# Altium schematic sheet SYSTEM.SchDoc: DARKYDEN_SYSTEM
size Letter; ApprovedBy: APPROUVÉ PAR; Author: Harold Malbrouck; Organization: Cegep Limoilou; Address1: 1300, 8e Avenue; Address2: Québec, QC; Address3: Canada; Address4: G1J 5L5; Revision: Rev.A; SheetNumber: 12; SheetTotal: 12
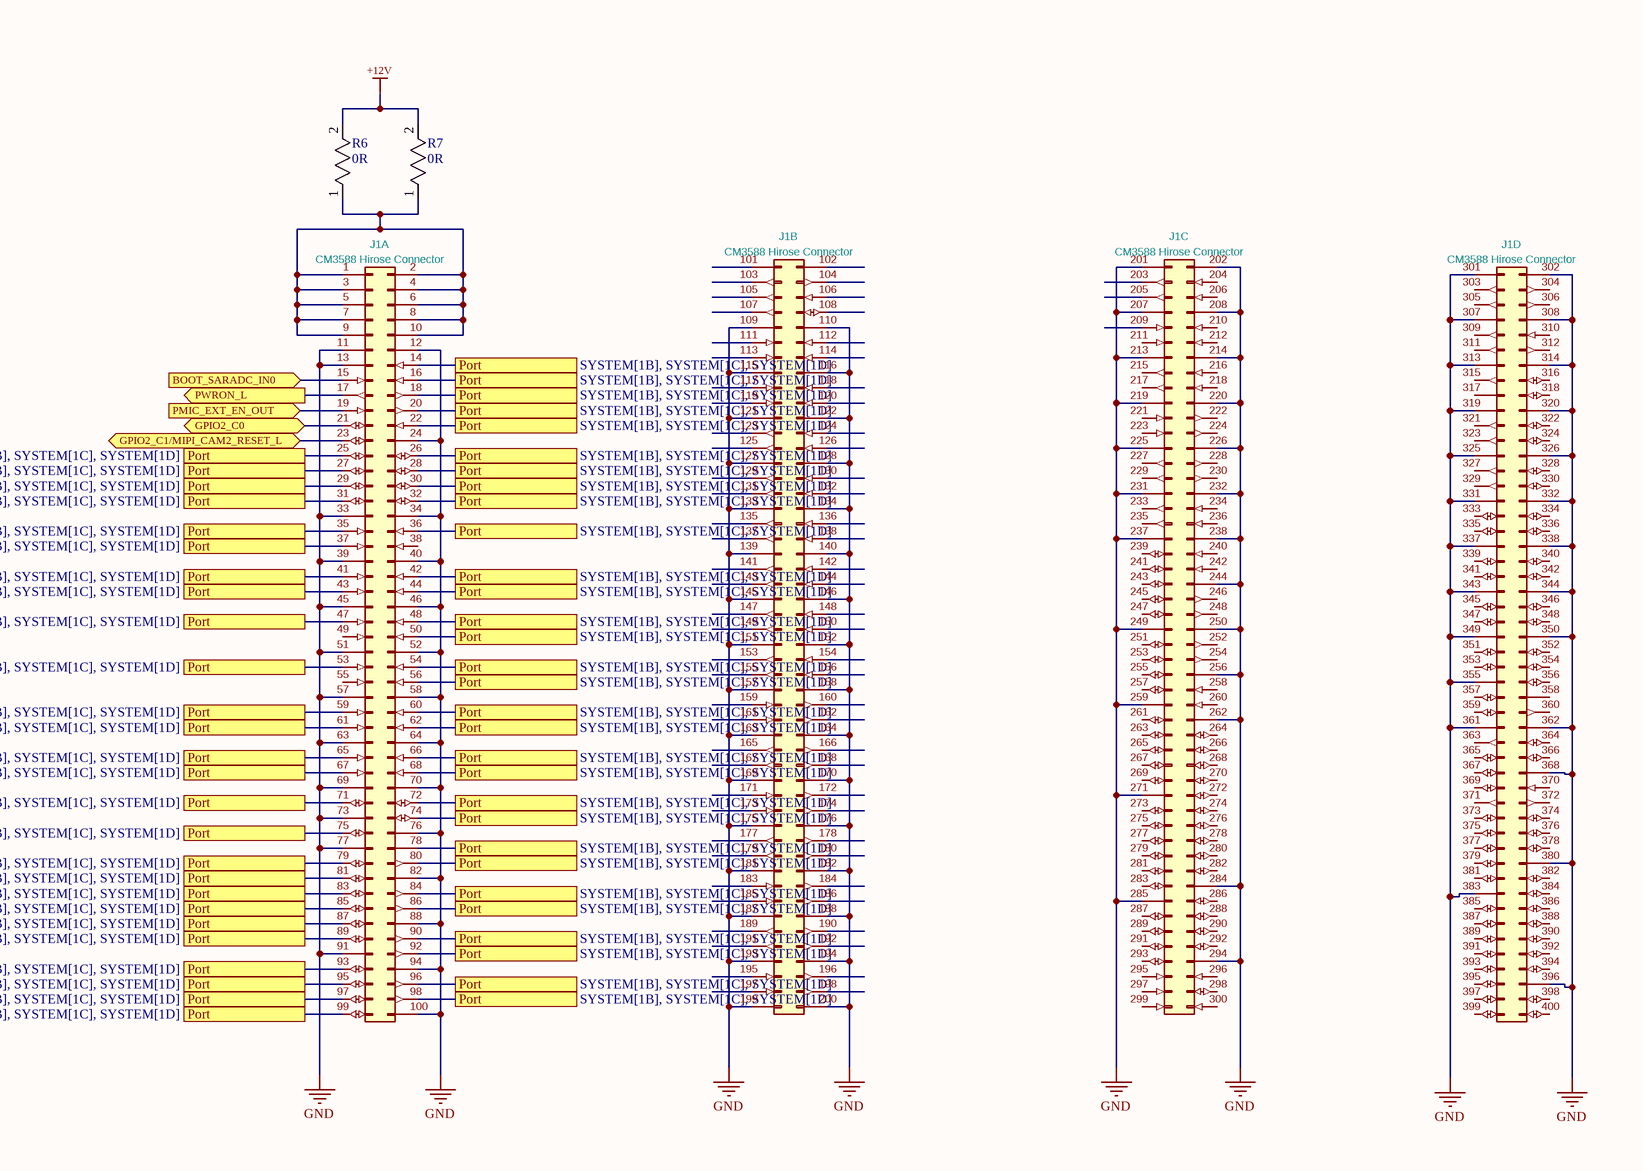
[diagram p0: SYSTEM.SchDoc, right]

## Parts
J1  CM3588 Hirose Connector  [CM3588]  (parts A,B,C,D of 4)
R6  0R  [RES_0816_SUS]
R7  0R  [RES_0816_SUS]

## Ports
BOOT_SARADC_IN0 (in), GPIO2_C0 (bidir), GPIO2_C1/MIPI_CAM2_RESET_L (bidir), PMIC_EXT_EN_OUT (in), Port (see SYSTEM[1B], SYSTEM[1C], SYSTEM[1D]), PWRON_L (out)

## Nets
+12V: R6.2 R7.2
GND: J1.11(GND) J1.12(GND) J1.13(GND) J1.24(GND) J1.33(GND) J1.34(GND) J1.39(GND) J1.40(GND) J1.45(GND) J1.46(GND) J1.51(GND) J1.52(GND) J1.57(GND) J1.58(GND) J1.63(GND) J1.64(GND) J1.69(GND) J1.70(GND) J1.73(GND) J1.76(GND) J1.77(GND) J1.82(GND) J1.88(GND) J1.91(GND) J1.94(GND) J1.100(GND) J1.109(GND) J1.110(GND) J1.115(GND) J1.116(GND) J1.121(GND) J1.122(GND) J1.127(GND) J1.128(GND) J1.133(GND) J1.134(GND) J1.139(GND) J1.140(GND) J1.145(GND) J1.146(GND) J1.151(GND) J1.152(GND) J1.157(GND) J1.158(GND) J1.163(GND) J1.164(GND) J1.169(GND) J1.170(GND) J1.175(GND) J1.176(GND) J1.181(GND) J1.182(GND) J1.187(GND) J1.188(GND) J1.193(GND) J1.194(GND) J1.199(GND) J1.200(GND) J1.201(GND) J1.202(GND) J1.207(GND) J1.208(GND) J1.213(GND) J1.214(GND) J1.219(GND) J1.220(GND) J1.225(GND) J1.226(GND) J1.231(GND) J1.232(GND) J1.237(GND) J1.238(GND) J1.244(GND) J1.249(GND) J1.250(GND) J1.256(GND) J1.259(GND) J1.262(GND) J1.271(GND) J1.284(GND) J1.285(GND) J1.294(GND) J1.301(GND) J1.302(GND) J1.307(GND) J1.308(GND) J1.313(GND) J1.314(GND) J1.319(GND) J1.320(GND) J1.325(GND) J1.326(GND) J1.331(GND) J1.332(GND) J1.337(GND) J1.338(GND) J1.343(GND) J1.344(GND) J1.349(GND) J1.350(GND) J1.355(GND) J1.361(GND) J1.362(GND) J1.368(GND) J1.380(GND) J1.383(GND) J1.396(GND)
BOOT_SARADC_IN0: J1.15(BOOT_SARADC_IN0) ; port BOOT_SARADC_IN0
GPIO2_C0: J1.21(GPIO2_C0) ; port GPIO2_C0
GPIO2_C1/MIPI_CAM2_RESET_L: J1.23(GPIO2_C1/MIPI_CAM2_RESET_L) ; port GPIO2_C1/MIPI_CAM2_RESET_L
PMIC_EXT_EN_OUT: J1.19(PMIC_EXT_EN_OUT) ; port PMIC_EXT_EN_OUT
Port: J1.14(SARADC_VIN6_HW_ID2) J1.16(RESET_L) J1.18(VDC_MODE) J1.20(UART2_TX_M0_DEBUG) J1.22(UART2_RX_M0_DEBUG) J1.25(GPIO2_C2/MIPI_CAM2_PDN_L) J1.26(GPIO4_C2) J1.27(GPIO2_C3) J1.28(GPIO4_C3) J1.29(GPIO2_C4) J1.30(GPIO4_C4) J1.31(GPIO4_C6) J1.32(GPIO4_C5) J1.35(MIPI_CSI1_RX_CLK1P) J1.36(MIPI_CSI0_RX_CLK1P) J1.37(MIPI_CSI1_RX_CLK1N) J1.41(MIPI_CSI1_RX_D3P) J1.42(MIPI_CSI0_RX_D3P) J1.43(MIPI_CSI1_RX_D3N) J1.44(MIPI_CSI0_RX_D3N) J1.47(MIPI_CSI1_RX_D2P) J1.48(MIPI_CSI0_RX_D2P) J1.50(MIPI_CSI0_RX_D2N) J1.53(MIPI_CSI1_RX_CLK0P) J1.54(MIPI_CSI0_RX_CLK0P) J1.56(MIPI_CSI0_RX_CLK0N) J1.59(MIPI_CSI1_RX_D1P) J1.60(MIPI_CSI0_RX_D1P) J1.61(MIPI_CSI1_RX_D1N) J1.62(MIPI_CSI0_RX_D1N) J1.65(MIPI_CSI1_RX_D0P) J1.66(MIPI_CSI0_RX_D0P) J1.67(MIPI_CSI1_RX_D0N) J1.68(MIPI_CSI0_RX_D0N) J1.71(GPIO1_B6) J1.72(LED3_25GLAN_25GLED) J1.74(LED2_25GLAN_1GLED) J1.75(GPIO1_B7) J1.78(P25G_MDIP0) J1.79(GPIO2_A6) J1.80(P25G_MDIN0) J1.81(GPIO2_A7) J1.83(GPIO2_B0) J1.84(P25G_MDIP1) J1.85(GPIO2_B1_GPIO,) J1.86(P25G_MDIN1) J1.87(GPIO2_B2) J1.89(GPIO2_B3) J1.90(P25G_MDIP2) J1.92(P25G_MDIN2) J1.93(GPIO2_B4) J1.95(GPIO2_B5) J1.96(P25G_MDIP3) J1.97(GPIO2_B6) J1.98(P25G_MDIN3) J1.99(GPIO2_B7) ; port Port
PWRON_L: J1.17(PWRON_L) ; port PWRON_L
NetJ1_1: J1.1(VDD_DCIN) J1.2(VDD_DCIN) J1.3(VDD_DCIN) J1.4(VDD_DCIN) J1.5(VDD_DCIN) J1.6(VDD_DCIN) J1.7(VDD_DCIN) J1.8(VDD_DCIN) J1.9(VDD_DCIN) J1.10(VDD_DCIN) R6.1 R7.1

Not connected (* = marked no-connect by the designer): J1 38(MIPI_CSI0_RX_CLK1N) 49(MIPI_CSI1_RX_D2N) 55(MIPI_CSI1_RX_CLK0N) 101(RECOVERY) 102(GND_AUDUO) 103(HPR) 104(HPL) 105(I2C7_SDA_M0) 106(MIC_IN) 107(I2C7_SCL_M0) 108(GPIO1_C4/HP_DET_L) 111(MIPI_DPHY0_RX_D2P) 112(MIPI_DPHY0_RX_D3P) 113(MIPI_DPHY0_RX_D2N) 114(MIPI_DPHY0_RX_D3N) 117(MIPI_DPHY0_RX_D1P) 118(MIPI_DPHY0_RX_CLKP) 119(MIPI_DPHY0_RX_D1N) 120(MIPI_DPHY0_RX_CLKN) 123(MIPI_DPHY0_TX_D3P) 124(MIPI_DPHY0_RX_D0P) 125(MIPI_DPHY0_TX_D3N) 126(MIPI_DPHY0_RX_D0N) 129(MIPI_DPHY0_TX_D2P) 130(MIPI_DPHY1_RX_D3P) 131(MIPI_DPHY0_TX_D2N) 132(MIPI_DPHY1_RX_D3N) 135(MIPI_DPHY0_TX_CLKP) 136(MIPI_DPHY1_RX_D2P) 137(MIPI_DPHY0_TX_CLKN) 138(MIPI_DPHY1_RX_D2N) 141(MIPI_DPHY0_TX_D1P) 142(MIPI_DPHY1_RX_CLKP) 143(MIPI_DPHY0_TX_D1N) 144(MIPI_DPHY1_RX_CLKN) 147(MIPI_DPHY0_TX_D0P) 148(MIPI_DPHY1_RX_D1P) 149(MIPI_DPHY0_TX_D0N) 150(MIPI_DPHY1_RX_D1N) 153(TYPEC0_SSTX2P) 154(MIPI_DPHY1_RX_D0P) 155(TYPEC0_SSTX2N) 156(MIPI_DPHY1_RX_D0N) 159(TYPEC0_SSRX2P) 160(MIPI_DPHY1_TX_D3P) 161(TYPEC0_SSRX2N) 162(MIPI_DPHY1_TX_D3N) 165(TYPEC0_SSTX1P) 166(MIPI_DPHY1_TX_D2P) 167(TYPEC0_SSTX1N) 168(MIPI_DPHY1_TX_D2N) 171(TYPEC0_SSRX1P) 172(MIPI_DPHY1_TX_CLKP) 173(TYPEC0_SSRX1N) 174(MIPI_DPHY1_TX_CLKN) 177(TYPEC1_SSTX2P) 178(MIPI_DPHY1_TX_D1P) 179(TYPEC1_SSTX2N) 180(MIPI_DPHY1_TX_D1N) 183(TYPEC1_SSRX2P) 184(MIPI_DPHY1_TX_D0P) 185(TYPEC1_SSRX2N) 186(MIPI_DPHY1_TX_D0N) 189(TYPEC1_SSTX1P) 190(TYPEC0_OTG_DP) 191(TYPEC1_SSTX1N) 192(TYPEC0_OTG_DM) 195(TYPEC1_SSRX1P) 196(TYPEC1_OTG_DP) 197(TYPEC1_SSRX1N) 198(TYPEC1_OTG_DM) 203(PCIE20_1_TXP/SATA30_1_TXP) 204(PCIE30_PORT0_RX0P) 205(PCIE20_1_TXN/SATA30_1_TXN) 206(PCIE30_PORT0_RX0N) 209(PCIE20_1_RXP/SATA30_1_RXP) 210(PCIE30_PORT0_RX1P) 211(PCPIE20_1_RXN/SATA30_1_RXN) 212(PCIE30_PORT0_RX1N) 215(PCIE20_1_REFCLKP) 216(PCIE30_PORT0_REFCLKP_IN) 217(PCIE20_1_REFCLKN) 218(PCIE30_PORT0_REFCLKN_IN) 221(PCIE20_2_RXP/SATA30_2_RXP/USB30_2_SSRXP) 222(PCIE30_PORT0_TX0P) 223(PCIE20_2_RXN/SATA30_2_RXN/USB30_2_SSRXN) 224(PCIE30_PORT0_TX0N) 227(PCIE20_2_REFCLKP) 228(PCIE30_PORT0_TX1P) 229(PCIE20_2_REFCLKN) 230(PCIE30_PORT0_TX1N) 233(PCIE20_2_TXP/SATA30_2_TXP/USB30_2_SSTXP) 234(PCIE30_PORT1_RX2P) 235(PCIE20_2_TXN/SATA30_2_TXN/USB30_2_SSTXN) 236(PCIE30_PORT1_RX2N) 239(GPIO1_D2) 240(PCIE30_PORT1_RX3P) 241(GPIO1_D3) 242(PCIE30_PORT1_RX3N) 243(GPIO1_C1) 245(GPIO1_C0) 246(PCIE30_PORT1_TX2P) 247(GPIO0_B2) 248(PCIE30_PORT1_TX2N) 251(GPIO4_A0) 252(PCIE30_PORT1_TX3P) 253(GPIO4_A1) 254(PCIE30_PORT1_TX3N) 255(GPIO4_A2) 257(GPIO4_A3) 258(PCIE30_PORT1_REFCLKP_IN) 260(PCIE30_PORT1_REFCLKN_IN) 261(GPIO4_B0) 263(GPIO4_B3) 264(GPIO0_D3) 265(GPIO4_B4) 266(GPIO0_D4) 267(GPIO4_B5) 268(GPIO0_D5) 269(GPIO4_B6) 270(GPIO0_C4) 272(GPIO0_C5) 273(GPIO1_A0) 274(GPIO0_C6) 275(GPIO1_A1) 276(GPIO1_B0) 277(GPIO1_A2) 278(GPIO1_B1) 279(GPIO1_A3) 280(GPIO1_B2) 281(GPIO1_A4) 282(GPIO1_B3) 283(GPIO1_A7) 286(GPIO1_D6) 287(GPIO3_C0) 288(GPIO1_D7) 289(GPIO3_C1) 290(GPIO1_B4) 291(GPIO3_C2) 292(GPIO1_B5) 293(GPIO3_C3) 295(HDMITX0_HPDIN_M0) 296(I2C6_SCL_M0) 297(HDMITX1_HPDIN_M0) 298(I2C6_SDA_M0) 299(GPIO1_D5/HDMIIRX_DET_L) 300(VBAT_RTC) 303(HDMI1_TX2P_PORT) 304(TYPEC0_SBU1_OUT) 305(HDMI1_TX2N_PORT) 306(TYPEC0_SBU2_OUT) 309(HDMI1_TX1P_PORT) 310(TYPEC1_SBU1) 311(HDMI1_TX1N_PORT) 312(TYPEC1_SBU2) 315(HDMI1_TX0P_PORT) 316(USB20_HOST1_DP) 317(HDMI1_TX0N_PORT) 318(USB20_HOST1_DM) 321(HDMI1_TX3P_PORT) 322(USB20_HOST0_DP) 323(HDMI1_TX3N_PORT) 324(USB20_HOST0_DM) 327(HDMI1_TX_SBDP) 328(HDMI_RX_D2P_PORT) 329(HDMI1_TX_SBDN) 330(HDMI_RX_D2N_PORT) 333(HDMI0_TX2P_PORT) 334(HDMI_RX_D1P_PORT) 335(HDMI0_TX2N_PORT) 336(HDMI_RX_D1N_PORT) 339(HDMI0_TX1P_PORT) 340(HDMI_RX_D0P_PORT) 341(HDMI0_TX1N_PORT) 342(HDMI_RX_D0N_PORT) 345(HDMI0_TX0P_PORT) 346(HDMI_RX_CLKP_PORT) 347(HDMI0_TX0N_PORT) 348(HDMI_RX_CLKN_PORT) 351(HDMI0_TX3P_PORT) 352(SDMMC0_D2) 353(HDMI0_TX3N_PORT) 354(SDMMC0_D3) 356(SDMMC0_CMD) 357(HDMI0_TX_SBDP) 358(VCC3V3_SD_S0) 359(HDMI0_TX_SBDN) 360(SD_CLK) 363(HDMITX0_SCL_M0) 364(SDMMC0_D0) 365(HDMITX0_SDA_M0) 366(SDMMC0_D1) 367(HDMITX0_CEC_M0) 369(HDMI0_TX_ON_H) 370(GPIO0_A4/SDMMC_DET_L) 371(HDMITX1_SCL_M1) 372(HDMI_RX_SCL_M1) 373(HDMITX1_SDA_M1) 374(HDMI_RX_SDA_M1) 375(HDMITX1_CEC_M2) 376(HDMI_RX_CEC) 377(HDMI1_TX_ON_H) 378(HDMIIRX_HPDOUT_H) 379(GPIO3_D0) 381(GPIO3_C7) 382(GPIO3_B0) 384(GPIO3_B1) 385(GPIO3_D5) 386(GPIO3_B2) 387(GPIO3_A0) 388(GPIO3_B3) 389(GPIO3_A1) 390(GPIO3_B4) 391(GPIO3_A2) 392(GPIO3_B5) 393(GPIO3_A3) 394(GPIO3_B6) 395(GPIO3_A4) 397(GPIO3_A5) 398(GPIO3_B7) 399(GPIO3_A6) 400(GPIO3_A7)

## Notes on the sheet
- Titre :
- Conception :
- Date :
- Approbation :
- Heure :
- Révision :
- Feuille
- de
- Fichier :

## Library data of the parts
J1 = CM3588: LCSC: C597931; Footprint: Library:CM3588; Value: CM3588 Hirose Connector
R6 R7 = RG1608P-104-B-T5: Zero Ohm Resistor, Jumper, 0603 [1608 Metric], Thick Film, 100 mW, 1 A, Surface Mount; Mfr_Name: Susumu; Manufacturer: NIC Components; Manufacturer Part Number: NRC06ZOTRF; Power Rating: 100mW; Current Rating: 1A; Supplier: Digikey; Supplier Part Number: 4988-NRC06ZOTRFCT-ND; RoHS: Yes; Category: Chip SMD Resistors; Stock: 97399; Pricing: 1=0.1, 10=0.028, 50=0.0168, 100=0.0138, 500=0.009, 1000=0.00766 (USD); Mounting Technology: Surface Mount; Case/Package: 0603; Contact Plating: Tin,Matte; Min Operating Temperature: -55°C; Max Operating Temperature: 155°C; Value: 0R; Packaging: Tape and Reel; Number of Terminations: 2; Construction: Rectangular; Technology: THICK FILM; Moisture Sensitivity Level: 1; Length: 1.6mm; Height: 0.45mm; Depth: 0.8mm; Military Standard: Not; Lead Free: Lead Free; RoHS Compliant: Yes; ComponentLink1URL: https://datasheet.ciiva.com/34303/2007791-34303771.pdf?src-supplier=Jameco; ComponentLink1Description: https://datasheet.ciiva.com/34303/2007791-34303771.pdf?src-supplier=Jameco; ComponentLink2URL: https://datasheet.ciiva.com/16199/nrc-16199372.pdf?src-supplier=Future+Electronics; ComponentLink2Description: https://datasheet.ciiva.com/16199/nrc-16199372.pdf?src-supplier=Future+Electronics; ComponentLink3URL: https://datasheet.ciiva.com/9179/nrc-9179190.pdf?src-supplier=Avnet; ComponentLink3Description: https://datasheet.ciiva.com/9179/nrc-9179190.pdf?src-supplier=Avnet